# EAGLE schematic NSL_Annoy (EAGLE 5.11)
MF: TEXAS INSTRUMENTS; MPN: NE555DR; OC_NEWARK: 75C4440
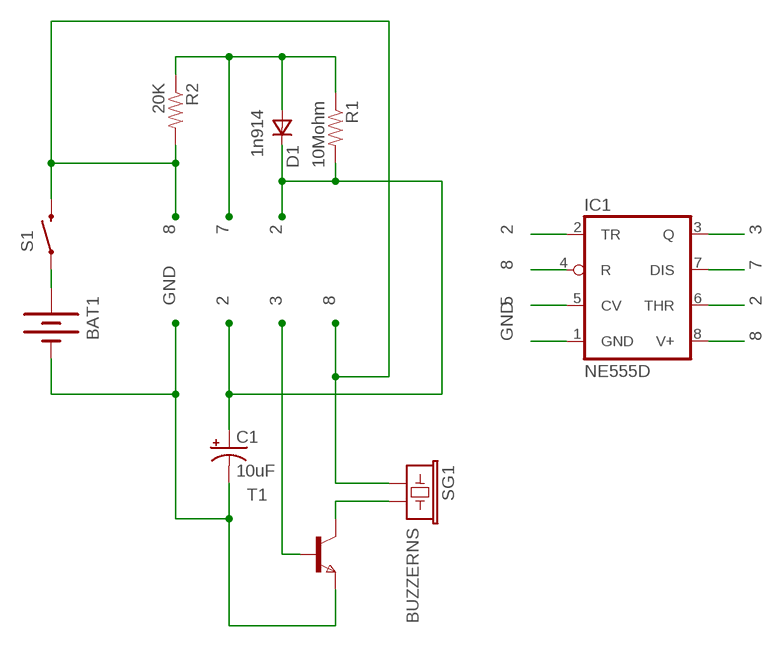
[diagram p0: schematic, sheet 1]

## Parts
BAT1  BATTERYFOB  [BATTERY_20MM_PTH_COMPACT]
C1  10uF  CAP_POL1206  [EIA3216]
D1  1n914  DSOD323  [SOD323]
IC1  NE555D  [SO08]
R1  10Mohm  RESISTOR0805-RES  [0805]
R2  20K  RESISTOR0805-RES  [0805]
S1  SPARKFUN_SWITCH-MOMENTARY-2-SMD-1101NE  [SPARKFUN_TACTILE-SWITCH-1101NE]
SG1  BUZZERNS  [BUZZER-12MM-NS]
T1  BC846T  [SOT416]

## Nets
2: C1.A(+) D1.1(C) IC1.2(TR) IC1.6(THR) R1.2
3: IC1.3(Q) T1.1(B)
5: IC1.5(CV)
7: D1.2(A) IC1.7(DIS) R1.1 R2.1
8: IC1.4(R) IC1.8(V+) R2.2 S1.P$2 SG1.+
GND: BAT1.2(-) C1.C(-) IC1.1(GND) T1.2(E)
N$1: BAT1.1(+) S1.P$1
N$9: SG1.- T1.3(C)

## Library data of the parts
BAT1 = SparkFun:BATTERY: Battery Holders Various common sizes : AA, AAA, 20mm coin cell and 12mm coin cell.
C1 = SparkFun:CAP_POL: Capacitor Polarized These are standard SMD and PTH capacitors. Normally 10uF, 47uF, and 100uF in electrolytic and tantalum varieties. Always verify the external diameter of the through hole cap, it varies with capacity, voltage, and manufacturer. The EIA devices should be standard.
D1 = zetex:D: DIODE; MPN: CDSOD323-T05C; OC_FARNELL: 1824860; OC_NEWARK: 79R6078
IC1 = linear:*555: TIMER
R1 R2 = SparkFun:RESISTOR: Resistor Basic schematic elements and footprints for 0603, 1206, and PTH resistors.
S1 = Nullspace:SPARKFUN_SWITCH-MOMENTARY-2
SG1 = SparkFun:BUZZER: Buzzer 12mm Spark Fun Electronics SKU : Comp-Buzzer
T1 = tvbgone-adj:BC846T: BC846T NPN general purpose transistors http://pdf1.alldatasheet.com/datasheet-pdf/view/16114/PHILIPS/BC846T.html